# Altium schematic sheet Colour-Sensor.SchDoc
size A4; Revision: 2.0
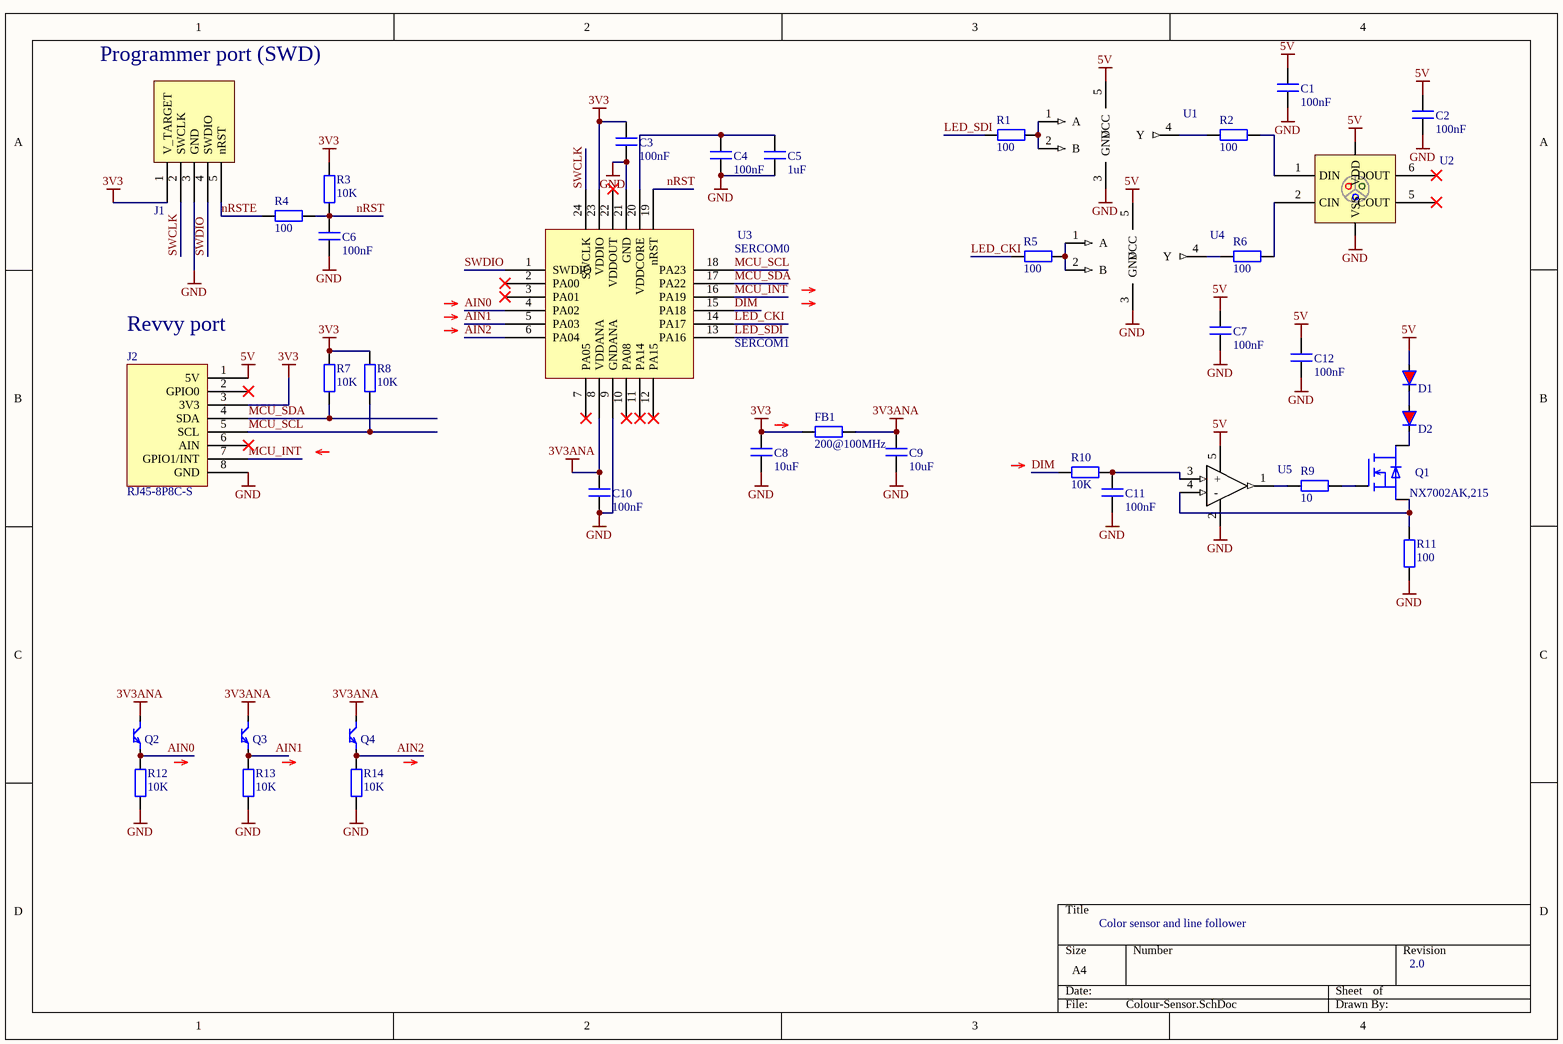
[diagram p0: Colour-Sensor.SchDoc]

## Parts
C1  100nF  [CAP1608X06M]
C2  100nF  [CAP1608X06M]
C3  100nF  [CAP1608X06M]
C4  100nF  [CAP1608X06M]
C5  1uF  [CAP1608X06M]
C6  100nF  [CAP1608X06M]
C7  100nF  [CAP1608X06M]
C8  10uF  [CAP1608X06M]
C9  10uF  [CAP1608X06M]
C10  100nF  [CAP1608X06M]
C11  100nF  [CAP1608X06M]
C12  100nF  [CAP1608X06M]
D1  LTST-C190CKT  [LEDC1608X90N]  (value not drawn)
D2  LTST-C190CKT  [LEDC1608X90N]  (value not drawn)
FB1  200@100MHz  [RESC1608X06M]
J1  SWD  [Sullins_GRPB051VWVN-RC]  (value not drawn)
J2  RJ45-8P8C-S  [RJ45-8P8C]
Q1  NX7002AK,215  [SOT-23-3]
Q2  KDT00030TR  [KDT00030TR]  (value not drawn)
Q3  KDT00030TR  [KDT00030TR]  (value not drawn)
Q4  KDT00030TR  [KDT00030TR]  (value not drawn)
R1  100  [RESC1608X06M]
R2  100  [RESC1608X06M]
R3  10K  [RESC1608X06M]
R4  100  [RESC1608X06M]
R5  100  [RESC1608X06M]
R6  100  [RESC1608X06M]
R7  10K  [RESC1608X06M]
R8  10K  [RESC1608X06M]
R9  10  [RESC1608X06M]
R10  10K  [RESC1608X06M]
R11  100  [RESC1608X06M]
R12  10K  [RESC1608X06M]
R13  10K  [RESC1608X06M]
R14  10K  [RESC1608X06M]
U1  OR gate  [SOT95P270X145-5N]  (value not drawn)
U2  APA102-2020  [APA102]  (value not drawn)
U3  ATSAML10D16  [QFN50P400X400X90_HS-25N]  (value not drawn)
U4  OR gate  [SOT95P270X145-5N]  (value not drawn)
U5  OpAmp  [SOT95P270X145-5N]  (value not drawn)

## Nets
3V3: C3.2 C8.2 FB1.1 J1.1(V_TARGET) J2.3(3V3) R3.2 R7.2 R8.2 U3.23(VDDIO)
3V3ANA: C9.2 C10.2 FB1.2 Q2.1(C) Q3.1(C) Q4.1(C) U3.8(VDDANA)
5V: C1.2 C2.2 C7.2 C12.2 D1.2(A) J2.1(5V) U1.5(VCC) U2.4(VDD) U4.5(VCC) U5.5(VDD)
GND: C1.1 C2.1 C3.1 C4.1 C5.1 C6.1 C7.1 C8.1 C9.1 C10.1 C11.1 C12.1 J1.3(GND) J2.8(GND) R11.1 R12.2 R13.2 R14.2 U1.3(GND) U2.3(VSS) U3.9(GNDANA) U3.21(GND) U4.3(GND) U5.2(VSS)
AIN0: Q2.2(E) R12.1 U3.4(PA02)
AIN1: Q3.2(E) R13.1 U3.5(PA03)
AIN2: Q4.2(E) R14.1 U3.6(PA04)
DIM: R10.2 U3.15(PA18)
LED_CKI: R5.1 U3.14(PA17)
LED_SDI: R1.1 U3.13(PA16)
MCU_INT: J2.7(GPIO1/INT) U3.16(PA19)
MCU_SCL: J2.5(SCL) R8.1 U3.18(PA23)
MCU_SDA: J2.4(SDA) R7.1 U3.17(PA22)
nRST: C6.2 R3.1 R4.2 U3.19(nRST)
nRSTE: J1.5(nRST) R4.1
SWCLK: J1.2(SWCLK) U3.24(SWCLK)
SWDIO: J1.4(SWDIO) U3.1(SWDIO)
NetC4_2: C4.2 C5.2 U3.20(VDDCORE)
NetC11_2: C11.2 R10.1 U5.3(+)
NetD1_1: D1.1(K) D2.2(A)
NetD2_1: D2.1(K) Q1.3(D)
NetQ1_1: Q1.1(G) R9.2
NetQ1_2: Q1.2(S) R11.2 U5.4(-)
NetR1_2: R1.2 U1.1(A) U1.2(B)
NetR2_1: R2.1 U1.4(Y)
NetR2_2: R2.2 U2.1(DIN)
NetR5_2: R5.2 U4.1(A) U4.2(B)
NetR6_1: R6.1 U4.4(Y)
NetR6_2: R6.2 U2.2(CIN)
NetR9_1: R9.1 U5.1(VOUT)

Not connected (* = marked no-connect by the designer): J2 2(GPIO0)* 6(AIN)*; U2 5(COUT)* 6(DOUT)*; U3 2(PA00)* 3(PA01)* 7(PA05)* 10(PA08)* 11(PA14)* 12(PA15)* 22(VDDOUT)*

## Notes on the sheet
- Programmer port (SWD)
- (near U3) SERCOM0
- (near J2) Revvy port
- (near U3) SERCOM1
- Color sensor and line follower

## Library data of the parts
C1-C4 C6 C7 C10-C12 = Capacitor 100n: Value: 100nF
C5 = Capacitor 1u: Value: 1uF
C8 C9 = Capacitor 10u: Value: 10uF
D1 D2 = LTST-C190CKT: LED; Manufacturer_Name: Lite-On; Datasheet Link: https://componentsearchengine.com/Datasheets/1/LTST-C190CKT.pdf; Height: 0.9mm; Mouser2 Part Number: 859-LTST-C190CKT; Mouser2 Price/Stock: https://www.mouser.com/Search/Refine.aspx?Keyword=859-LTST-C190CKT; Manufacturer_Part_Number: LTST-C190CKT
FB1 = Generic ferrite bead: Value: 200@100MHz
Q1 = NX7002AK,215: Part Description: MOSFET, N-CH, 60V, 190mA, -55/+150, TO-236AB; Manufacturer: Nexperia; Part Number: NX7002AK,215; Device: NX7002AK,215; Footprint: TO-236AB; Manufacturer Part Number: NX7002AK,215; Mounted: Yes; SMD: Yes; ComponentHeight: 1.1mm; Author: ChAl
Q2-Q4 = KDT00030TR: Phototransistor; Manufacturer_Name: ON Semiconductor; Datasheet Link: https://www.onsemi.com/pub/Collateral/KDT00030-D.PDF; Height: 0.6mm; Manufacturer_Part_Number: KDT00030TR
R1 R2 R4-R6 R11 = Resistor 100: Value: 100
R3 R7 R8 R10 R12-R14 = Resistor 10K: Value: 10K
R9 = Resistor 10: Value: 10
U1 U4 = SN74LV1T32: Manufacturer_Name: Texas Instruments; Manufacturer_Part_Number: SN74LV1T32DCKR; Datasheet Link: http://www.ti.com/lit/ds/symlink/sn74lv1t32.pdf; Mouser2 Price/Stock: https://hu.mouser.com/Search/Refine?Keyword=SN74LV1T32DCKR; Mouser code: 595-SN74LV1T32DCKR
U2 = APA102-2020: RGB LED
U3 = ATSAML10D16: 48MHz 32bit ARM MCU; Flash size: 16kB; RAM size: 4kB
U5 = MCP6001T-I_OT: Integrated Circuit; Manufacturer_Name: Microchip; Manufacturer_Part_Number: MCP6001T-I/OT; Datasheet Link: https://componentsearchengine.com/Datasheets/1/MCP6001T-I_OT.pdf; Height: 1.45mm; Mouser2 Part Number: 579-MCP6001T-I/OT; Mouser2 Price/Stock: https://www.mouser.com/Search/Refine.aspx?Keyword=579-MCP6001T-I%2FOT
J2 = RJ45-8P8C-S: Datasheet: /Robotics%20Platform/Datasheets/Connectors/5721-8P8C-全塑有耳.pdf